# Altium schematic sheet 20-Zigbee.SchDoc
size A4
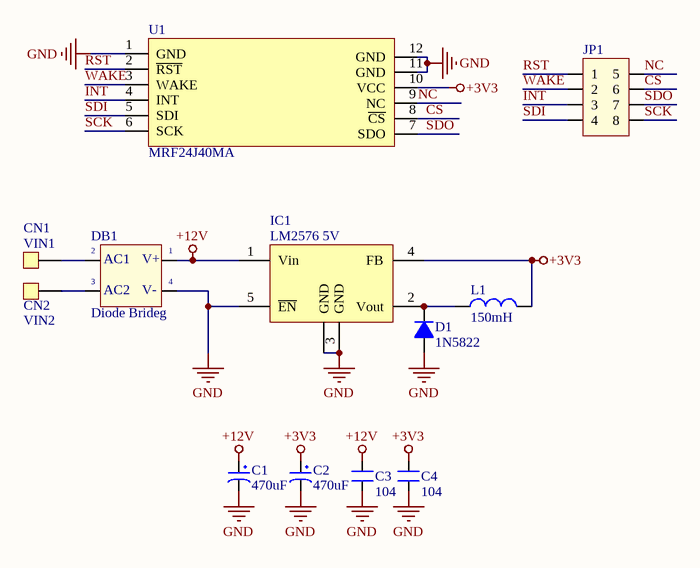
[diagram p0: 20-Zigbee.SchDoc]

## Parts
C1  470uF  [C-TANT-7343-31-CASEA]
C2  470uF  [C-TANT-7343-31-CASEA]
C3  104  [C-0805]
C4  104  [C-0805]
CN1  VIN1  [M3]
CN2  VIN2  [M3]
D1  1N5822  [D-DO214-AB]
DB1  Diode Brideg  [D-DB-1A-SMD]
IC1  LM2576 5V  [TO-263-5L]
JP1  Connector 4x2  [JP4x2]  (value not drawn)
L1  150mH  [L-SMD-10x10]
U1  MRF24J40MA  [MRF24J40]

## Nets
+3V3: C2.1 C4.2 IC1.4(FB) L1.2 U1.10(VCC)
+12V: C1.1 C3.2 DB1.3(AC2) IC1.1(Vin)
GND: C1.2 C2.2 C3.1 C4.1 D1.1(A) DB1.4(-V_OUT) IC1.3(GND) IC1.5(~{EN}) IC1.HM(GND) U1.1(GND) U1.11(GND) U1.12(GND)
CS: JP1.6 U1.8(~{C}~{S})
INT: JP1.3 U1.4(INT)
NC: JP1.5 U1.9(NC)
RST: JP1.1 U1.2(~{RST})
SCK: JP1.8 U1.6(SCK)
SDI: JP1.4 U1.5(SDI)
SDO: JP1.7 U1.7(SDO)
WAKE: JP1.2 U1.3(WAKE)
NetCN1_1: CN1.1 DB1.2(AC1)
NetCN2_1: CN2.1 DB1.1(+V_OUT)
NetD1_2: D1.2(K) IC1.2(Vout) L1.1

## Notes on the sheet
- (in symbol DB) V+; V-

## Library data of the parts
C1 C2 = CP1: Cap P  0,1uF < 22uF , 16 - 50V; Value: 10uF/50V; Description 1: 10 => 220uF/6,3V/10V - 10uF => 100uF/16V; Description 2: 0,1uF => 33uF/50V - 10uF => 22uF/63V; Description 3: 0,47uF => 10uF/100V
C3 C4 = CN: Value: 0,1uF/300V; Designed by: VanDungEvn
CN1 CN2 = COCDONGM3: Value: M3
D1 = D1A: Diode 1A; Value: 1N4007
DB1 = DB: Convert AC to DC voltage, 4 pin; Value: Cau 1A
IC1 = LM2576
JP1 = JP4x2: Value: Connector 4x2
L1 = L1: Inductor; Value: 150 mH